# Altium schematic sheet JSTCJ.SchDoc
size A4; SheetNumber: 1; SheetTotal: 1
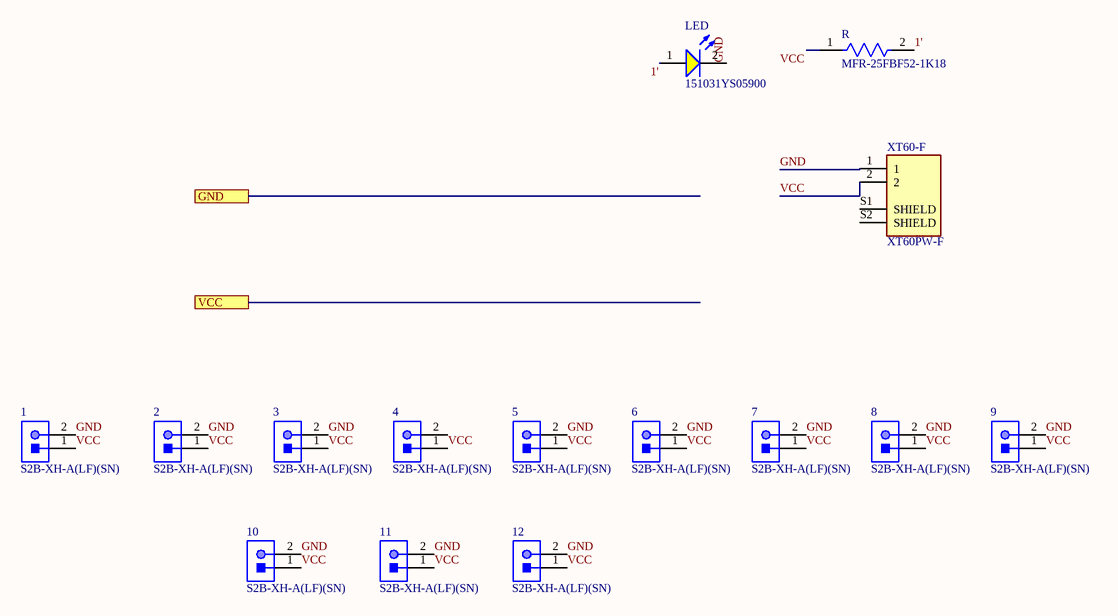
[diagram p0: JSTCJ.SchDoc]

## Parts
1  S2B-XH-A(LF)(SN)  [JST-S2B-XH-A(LF)(SN)_V]
2  S2B-XH-A(LF)(SN)  [JST-S2B-XH-A(LF)(SN)_V]
3  S2B-XH-A(LF)(SN)  [JST-S2B-XH-A(LF)(SN)_V]
4  S2B-XH-A(LF)(SN)  [JST-S2B-XH-A(LF)(SN)_V]
5  S2B-XH-A(LF)(SN)  [JST-S2B-XH-A(LF)(SN)_V]
6  S2B-XH-A(LF)(SN)  [JST-S2B-XH-A(LF)(SN)_V]
7  S2B-XH-A(LF)(SN)  [JST-S2B-XH-A(LF)(SN)_V]
8  S2B-XH-A(LF)(SN)  [JST-S2B-XH-A(LF)(SN)_V]
9  S2B-XH-A(LF)(SN)  [JST-S2B-XH-A(LF)(SN)_V]
10  S2B-XH-A(LF)(SN)  [JST-S2B-XH-A(LF)(SN)_V]
11  S2B-XH-A(LF)(SN)  [JST-S2B-XH-A(LF)(SN)_V]
12  S2B-XH-A(LF)(SN)  [JST-S2B-XH-A(LF)(SN)_V]
LED  151031YS05900  [WL-TMRC_D3.95H5.3]
R  MFR-25FBF52-1K18  [FP-MFR-25-MFG]
XT60-F  XT60PW-F  [AMASS_XT60PW-F]

## Ports
GND, VCC

## Nets
1': LED.1(A) R.2
GND: 1.2 2.2 3.2 5.2 6.2 7.2 8.2 9.2 10.2 11.2 12.2 LED.2(K) XT60-F.1
VCC: 1.1 2.1 3.1 4.1 5.1 6.1 7.1 8.1 9.1 10.1 11.1 12.1 R.1 XT60-F.2

Not connected (* = marked no-connect by the designer): 4 2; XT60-F S1(SHIELD) S2(SHIELD)

## Library data of the parts
1-12 = CMP-002-00032-2: Male Header, Pitch 2.5 mm, 1 x 2 Position, Height 6.1 mm, Tail Length 3.4 mm, -25 to 85 degC, RoHS, Bulk; Manufacturer: JST; Case/Package: S2B-XH-A(LF)(SN); Package Description: XH Series Disconnectable Crimp Style Connector, Pitch 2.5 mm, 1 x 2 Position, Height 6.1 mm, Tail Length 3.4 mm; Manufacturer URL: http://www.jst.com/home2.html; Datasheet URL: http://www.jst-mfg.com/product/pdf/eng/eXH.pdf; Connector Type: Header; Package Reference: S2B-XH-A(LF)(SN); Mounting Technology: TH; Max Operating Temperature: 85°C; Min Operating Temperature: -25°C; Datasheet Version: May-16; Gender: Male; RoHS Compliant: Unknown
LED = CMP-1488-00003-2: NexarPartId: 29717806; Wavelength: 585nm; Forward Voltage: 2.1V; Lens Style: Circular, Diffused, Round; Viewing Angle: 60°; Forward Current: 100mA; Dominant Wavelength: 590nm; Test Current: 20mA; Max Reverse Voltage (DC): 5V; Luminous Intensity: 30mcd; Lens Size: 3mm; Max Operating Temperature: 85°C; Mount: Through Hole; Color: Yellow; Length: 3mm; Packaging: Bulk; Width: 3mm; Height: 5.3mm; Min Operating Temperature: -40°C; RoHS: Compliant; REACH SVHC: Unknown; Case/Package: Radial; Peak Wavelength: 585nm
R = CMP-03413-000001-1: RES 1.18K OHM 1/4W 1% AXIAL; Manufacturer: Yageo; Value: 1.18kΩ; Temperature Coefficient: 100ppm/°C; Power Rating: 0.25W; Voltage Rating: 250V; Temperature: -55°C to +155°C; Automotive: No; Temperature Range High: +155°C; Mouser Description: Metal Film Resistors 1.18K OHM 1/4W 1%; Digikey Description: RES 1.18K OHM 1/4W 1% AXIAL; Lead Free: Yes; Tolerance: 1%; ComponentLink2Description: Datasheet; ComponentLink2URL: https://www.yageo.com/upload/media/product/products/datasheet/lr/Yageo_LR_MFR_1.pdf; Temperature Range Low: -55°C; Package: MFR-25; Ipc Land Pattern Name: RESAD1000W75L680D260; Composition: Metal Film; Category: Res; Octopart: https://octopart.com/mfr-25fbf52-1k18-yageo-56251681; Series: MFR; Device Class L2: Resistors; Height: 2.6mm; Resistance: 1.18kΩ; Device Class L3: Through-Hole Resistors; Manufacturer Part Number: MFR-25FBF52-1K18; RoHS: TRUE; Device Class L1: Passive Components
XT60-F = CMP-007-000000-1: Socket DC Supply Connector Female; MF: AMASS; Check_prices: https://www.snapeda.com/parts/XT60PW-F/AMASS/view-part/?ref=eda; MP: XT60PW-F; Source: XT60PW-F.SchLib; Component Type: Standard; Package: Package; Value: *; SnapEDA_Link: https://www.snapeda.com/parts/XT60PW-F/AMASS/view-part/?ref=snap; Pin Count: 4; Price: None; Availability: Not in stock; Design Item ID: XT60PW-F